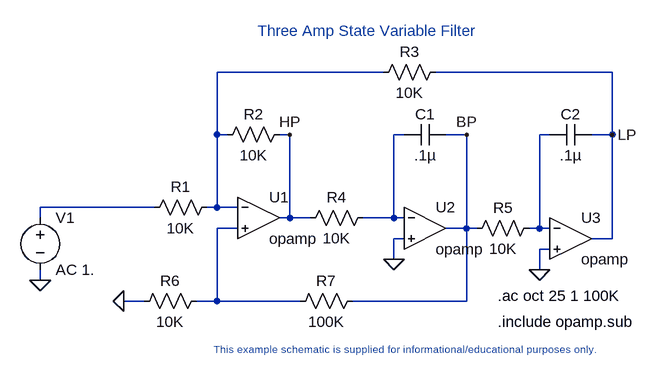
[diagram p0: schematic opamp.asc]
opamp.asc, the LTspice schematic file:
Version 4
SHEET 1 5945676 13421556
WIRE 1680 -144 1424 -144
WIRE 2032 -144 1760 -144
WIRE 1424 -48 1424 -144
WIRE 1440 -48 1424 -48
WIRE 1536 -48 1520 -48
WIRE 1712 -48 1696 -48
WIRE 1808 -48 1776 -48
WIRE 1936 -48 1920 -48
WIRE 2032 -48 2032 -144
WIRE 2032 -48 2000 -48
WIRE 1328 64 1152 64
WIRE 1424 64 1424 -48
WIRE 1424 64 1408 64
WIRE 1456 64 1424 64
WIRE 1152 80 1152 64
WIRE 1536 80 1536 -48
WIRE 1536 80 1520 80
WIRE 1568 80 1536 80
WIRE 1696 80 1696 -48
WIRE 1696 80 1648 80
WIRE 1712 80 1696 80
WIRE 1456 96 1424 96
WIRE 1808 96 1808 -48
WIRE 1808 96 1776 96
WIRE 1824 96 1808 96
WIRE 1920 96 1920 -48
WIRE 1920 96 1904 96
WIRE 1936 96 1920 96
WIRE 1712 112 1696 112
WIRE 2032 112 2032 -48
WIRE 2032 112 2000 112
WIRE 1936 128 1920 128
WIRE 1696 144 1696 112
WIRE 1920 160 1920 128
WIRE 1152 176 1152 160
WIRE 1312 208 1280 208
WIRE 1424 208 1424 96
WIRE 1424 208 1392 208
WIRE 1552 208 1424 208
WIRE 1808 208 1808 96
WIRE 1808 208 1632 208
FLAG 1152 176 0
FLAG 1696 144 0
FLAG 1920 160 0
FLAG 1280 208 0
FLAG 2032 -48 LP
FLAG 1536 -48 HP
FLAG 1808 -48 BP
SYMBOL voltage 1152 64 R0
SYMATTR InstName V1
SYMATTR Value AC 1.
SYMBOL res 1424 48 R90
WINDOW 0 0 56 VBottom 2
WINDOW 3 32 56 VTop 2
SYMATTR InstName R1
SYMATTR Value 10K
SYMBOL res 1536 -64 R90
WINDOW 0 0 56 VBottom 2
WINDOW 3 32 56 VTop 2
SYMATTR InstName R2
SYMATTR Value 10K
SYMBOL res 1776 -160 R90
WINDOW 0 0 56 VBottom 2
WINDOW 3 32 56 VTop 2
SYMATTR InstName R3
SYMATTR Value 10K
SYMBOL res 1664 64 R90
WINDOW 0 0 56 VBottom 2
WINDOW 3 32 56 VTop 2
SYMATTR InstName R4
SYMATTR Value 10K
SYMBOL res 1920 80 R90
WINDOW 0 0 56 VBottom 2
WINDOW 3 32 56 VTop 2
SYMATTR InstName R5
SYMATTR Value 10K
SYMBOL cap 1776 -64 R90
WINDOW 0 0 32 VBottom 2
WINDOW 3 32 32 VTop 2
SYMATTR InstName C1
SYMATTR Value .1µ
SYMBOL cap 2000 -64 R90
WINDOW 0 0 32 VBottom 2
WINDOW 3 32 32 VTop 2
SYMATTR InstName C2
SYMATTR Value .1µ
SYMBOL res 1408 192 R90
WINDOW 0 0 56 VBottom 2
WINDOW 3 32 56 VTop 2
SYMATTR InstName R6
SYMATTR Value 10K
SYMBOL res 1648 192 R90
WINDOW 0 0 56 VBottom 2
WINDOW 3 32 56 VTop 2
SYMATTR InstName R7
SYMATTR Value 100K
SYMBOL OPAMPS\\OPAMP 1488 16 R0
SYMATTR InstName U1
SYMBOL OPAMPS\\OPAMP 1744 32 R0
SYMATTR InstName U2
SYMBOL OPAMPS\\OPAMP 1968 48 R0
SYMATTR InstName U3
TEXT 1856 200 Left 2 !.ac oct 25 1 100K
TEXT 1856 240 Left 2 !.include opamp.sub
TEXT 1704 272 Top 1 ;This example schematic is supplied for informational/educational purposes only.
TEXT 1656 -192 Bottom 2 ;Three Amp State Variable Filter

The netlist it stands for:
* opamp.asc
V1 N004 0 AC 1.
R1 N001 N004 10K
R2 HP N001 10K
R3 LP N001 10K
R4 N002 HP 10K
R5 N003 BP 10K
C1 BP N002 .1µ
C2 LP N003 .1µ
R6 N005 0 10K
R7 BP N005 100K
XU1 N001 N005 HP opamp Aol=100K GBW=10Meg  ; pins invin noninvin out
XU2 N002 0 BP opamp Aol=100K GBW=10Meg  ; pins invin noninvin out
XU3 N003 0 LP opamp Aol=100K GBW=10Meg  ; pins invin noninvin out
.ac oct 25 1 100K
.include opamp.sub
* This example schematic is supplied for informational/educational purposes only.
* Three Amp State Variable Filter
.backanno
.end